# Altium schematic sheet Sheet1.SchDoc
size A
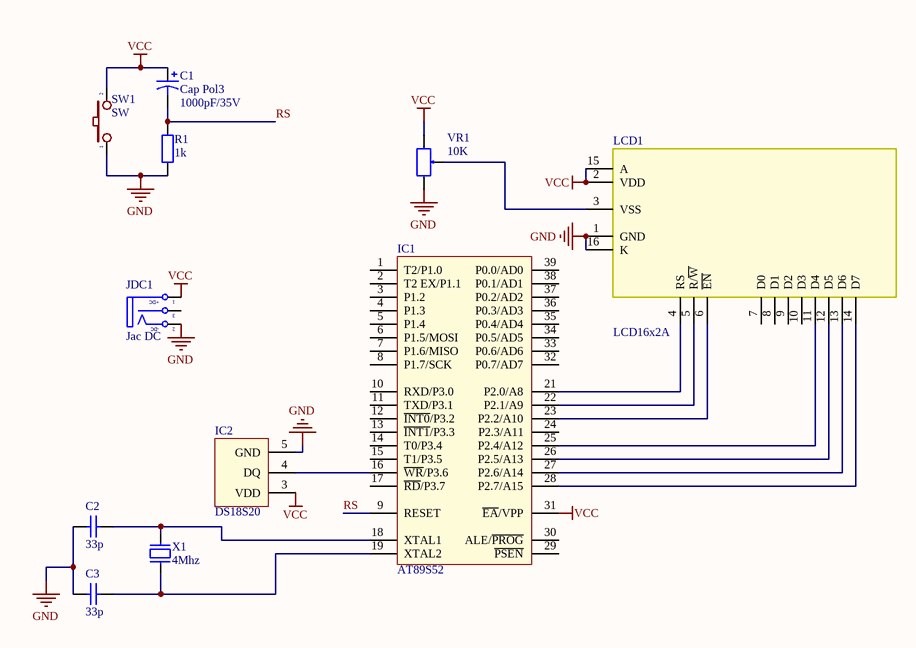
[diagram p0: Sheet1.SchDoc]

## Parts
C1  Cap Pol3  value 1000pF/35V  [CP2/5]
C2  value 33p  [Tu-pico]  (hidden comment: Capacitor Ceramic)
C3  value 33p  [Tu-pico]  (hidden comment: Capacitor Ceramic)
IC1  AT89S52  [DIP40/W0.6]
IC2  DS18S20  [DS18S20]
JDC1  Jac DC  [DC-IN]
LCD1  LCD16x2A  [LCD16X2]
R1  1k  [R1/4W]
SW1  SW  [SW2]
VR1  10K  [VR]
X1  4Mhz  [XT2]

## Nets
GND: C2.1 C3.1 IC1.20(GND) IC2.5(GND) JDC1.2(TN) LCD1.1(GND) LCD1.16(K) R1.1 SW1.1 VR1.3
VCC: C1.1 IC1.31(~{EA}/VPP) IC1.40(VCC) IC2.3(VDD) JDC1.1(T) LCD1.2(VDD) LCD1.15(A) SW1.2 VR1.1
RS: C1.2 IC1.9(RESET) R1.2
NetC2_2: C2.2 IC1.18(XTAL1) X1.1
NetC3_2: C3.2 IC1.19(XTAL2) X1.2
NetIC1_16: IC1.16(~{WR}/P3.6) IC2.4(DQ)
NetIC1_21: IC1.21(P2.0/A8) LCD1.4(RS)
NetIC1_22: IC1.22(P2.1/A9) LCD1.5(R/~{W})
NetIC1_23: IC1.23(P2.2/A10) LCD1.6(~{EN})
NetIC1_25: IC1.25(P2.4/A12) LCD1.11(D4)
NetIC1_26: IC1.26(P2.5/A13) LCD1.12(D5)
NetIC1_27: IC1.27(P2.6/A14) LCD1.13(D6)
NetIC1_28: IC1.28(P2.7/A15) LCD1.14(D7)
NetLCD1_3: LCD1.3(VSS) VR1.2

Not connected (* = marked no-connect by the designer): IC1 1(T2/P1.0) 2(T2_EX/P1.1) 3(P1.2) 4(P1.3) 5(P1.4) 6(P1.5/MOSI) 7(P1.6/MISO) 8(P1.7/SCK) 10(RXD/P3.0) 11(TXD/P3.1) 12(~{INT0}/P3.2) 13(~{INT1}/P3.3) 14(T0/P3.4) 15(T1/P3.5) 17(~{RD}/P3.7) 24(P2.3/A11) 29(~{PSEN}) 30(ALE/~{PROG}) 32(P0.7/AD7) 33(P0.6/AD6) 34(P0.5/AD5) 35(P0.4/AD4) 36(P0.3/AD3) 37(P0.2/AD2) 38(P0.1/AD1) 39(P0.0/AD0); JDC1 3(S); LCD1 7(D0) 8(D1) 9(D2) 10(D3)

## Notes on the sheet
- (in symbol DCIN) +DC; -DC

## Library data of the parts
C1 = Cap Pol3: Polarized Capacitor (Surface Mount); VALUE: C?; LatestRevisionDate: 17-Jul-2002; LatestRevisionNote: Re-released for DXP Platform.; PackageReference: C0805; Publisher: Altium Limited
C2 C3 = CapCeramic: Capacitor; Published: 8-Jun-2000; LatestRevisionDate: 17-Jul-2002; LatestRevisionNote: Re-released for DXP Platform.; PackageReference: RAD-0.3; Publisher: Altium Limited
IC1 = AT89S52: AT89S52, 8k Byte Flash Memory , 40 Pin; Value: AT89S52
IC2 = DS18S20: High Precision  1-Wire® Digital Thermometer
JDC1 = DCIN: Jac DC input; Value: Jac DC
LCD1 = LCD16x2: LCD dipslay 16 char, 2 line; Value: LCD16x2A
R1 = R1/4W: Resistor 1/4W; Value: R1/4W - 1K
SW1 = SW2: Switch button 2 pin; Value: SW chip 2 pin
VR1 = VR: Var Resistor; Value: VR 10K
X1 = XT2: Crystal For all Crystal 2pin.; Value: 4Mhz